# EasyEDA Pro project 电压采样隔离前级.eprj

# Schematic Schematic1
Board Name: Board1; Create Date: 2025-07-23
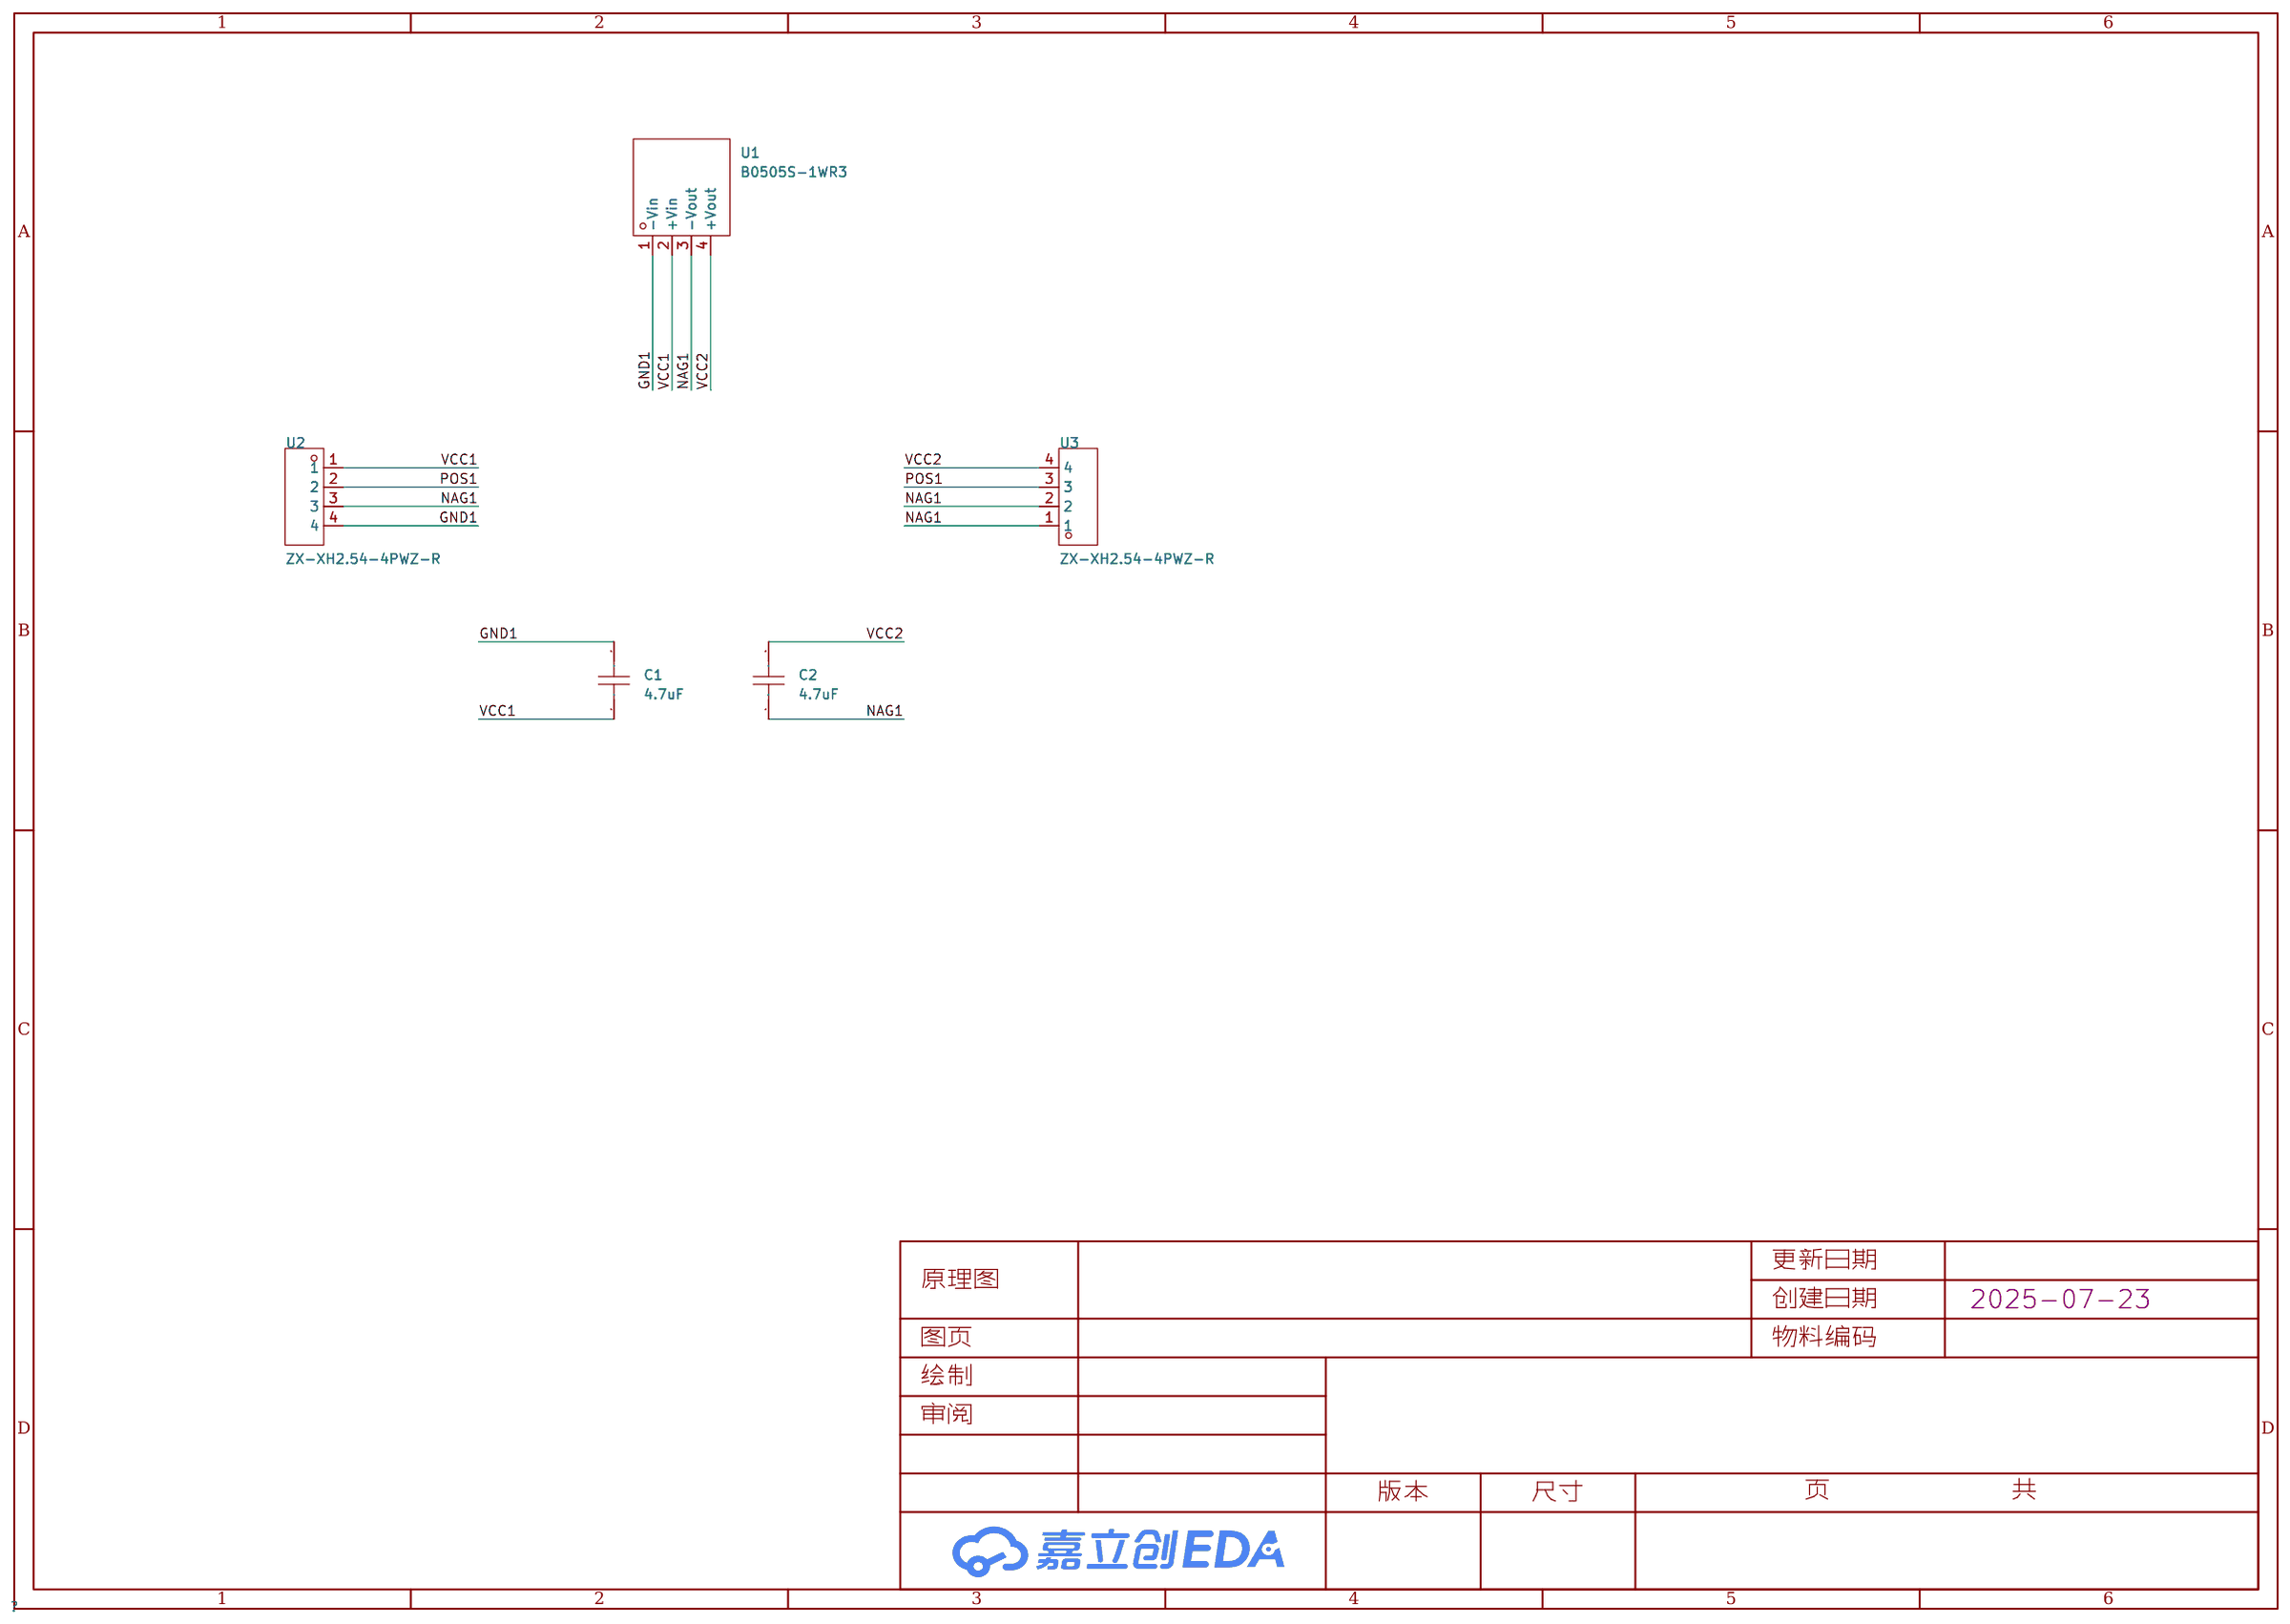
[diagram p0: schematic sheet]

## Parts
C1  4.7uF  [C1206]
C2  4.7uF  [C1206]
U1  B0505S-1WR3  [PWRM-TH_B0505S-1WR3]
U2  ZX-XH2.54-4PWZ-R  [CONN-TH_4P-P2.50_ZX-XH2.54-4PWZ-Y]
U3  ZX-XH2.54-4PWZ-R  [CONN-TH_4P-P2.50_ZX-XH2.54-4PWZ-Y]

## Library data of the parts
C1 C2 = GRM31CC72A475KE11L: LCSC Part Name: 4.7uF ±10% 100V; Supplier Part: C237304; Manufacturer: muRata(村田); Supplier Footprint: 1206; JLCPCB Part Class: 扩展库; Datasheet: https://atta.szlcsc.com/upload/public/pdf/source/20200508/C237304_4DE028CC8A94E401326C46A1633456FC.pdf; Supplier: LCSC; Tolerance: ±10%; Voltage Rated: 100V; Temperature Coefficient: X7S
U1 = B0505S-1WR3_C7465178: LCSC Part Name: DC-DC输入5V输出5V200mA 1W输出短路保护; Supplier Part: C7465178; Manufacturer: EVISUN(易成); Supplier Footprint: SIP-4; JLCPCB Part Class: 扩展库; Datasheet: https://atta.szlcsc.com/upload/public/pdf/source/20230718/BF3EB05DF14EA4A594DA80D4BE82711A.pdf; Supplier: LCSC; Power: 1W; input voltage (Vdc): 4.5V~5.5V; Conversion Efficiency: 86%; Output Voltage: 5V; Output Current (Max): 200mA; Maximum Capacitive Load: 2400uF; Insulated Voltage: 1.5kV; Protective function: 短路保护
U2 U3 = ZX-XH2.54-4PWZ-R: LCSC Part Name: 1x4P 间距:2.5mm 弯插 系列:XH; Supplier Part: C22388621; Manufacturer: Megastar(兆星); Supplier Footprint: 弯插,P=2.5mm; JLCPCB Part Class: 扩展库; Datasheet: https://atta.szlcsc.com/upload/public/pdf/source/20240429/B2359B43FD84E3B0CA319B3026062A11.pdf; Supplier: LCSC; Pins Structure: 1x4P; Pitch: 2.5mm; Mounting Type: 弯插; Reference Series: XH; Number of Pins: 4P; Number of Rows: 1; Number of PINs Per Row: 4; Current Rating: 3A; Contact Material: 铜合金; Contact Plating: 锡; Operating Temperature: -25℃~+85℃; Voltage Rating: 250V; Plastic Material: PA66; Color: 红色; X-Length of Bottom Edge on Board (Spacing Line): 12.5mm

## Nets
GND1: C1.2 U1.1(-Vin) U2.4
VCC1: C1.1 U1.2(+Vin) U2.1
VCC2: C2.2 U1.4(+Vout) U3.4
NAG1: C2.1 U1.3(-Vout) U2.3 U3.1 U3.2
POS1: U2.2 U3.3

# Board PCB1
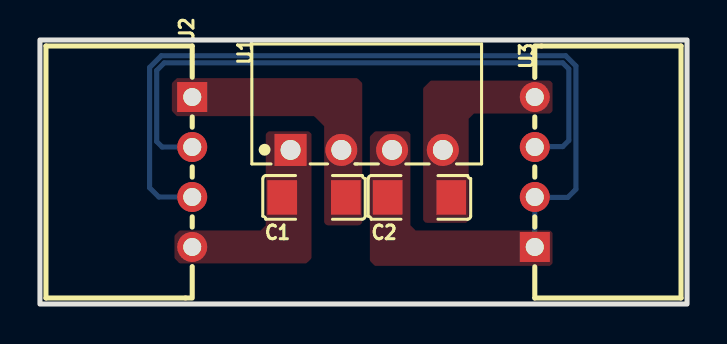
[diagram p1: board, top side]
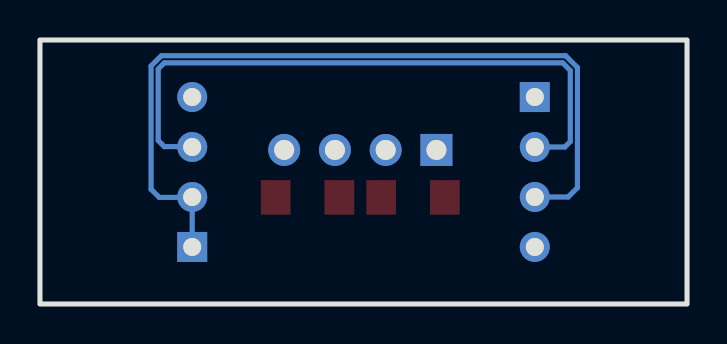
[diagram p2: board, bottom side, seen from below]

Outline 32.38 x 13.21 mm; copper layers: Top Layer, Bottom Layer. Coordinates in mm from the lower left corner of the outline.
Outline path: rectangle 0,13.21 32.38,0
Stack: Top Layer 0.035mm / Dielectric1 1.51mm FR4 er 4.5 / Bottom Layer 0.035mm

## Design rules (mm)
template: 自定义配置
spacing copperThickness1oz (default): track to track 0.102, other pairs 0.152 to 0.3
spacing copperThickness2oz: track to track 0.203, other pairs 0.152 to 0.3
track width copperThickness1oz (default): min 0.127, default 0.254, max 2.54
track width copperThickness2oz: min 0.203, default 0.254, max 2.54
differential pair differentialPair (default): width min 0.127, default 0.254, max 2.54; gap min 0.152, default 0.152
via viaSize (default): diameter min 0.5, default 0.61, max 10; hole min 0.3, default 0.305, max 6.3
net GND1 uses copperRegion1
net VCC1 uses copperRegion1
net VCC2 uses copperRegion1
net NAG1 uses copperRegion1

## Placement (name value [footprint] x y rotation side)
C1  4.7uF  [C1206]  13.72 5.33 180 top
C2  4.7uF  [C1206]  18.99 5.33 0 top
U1  B0505S-1WR3  [PWRM-TH_B0505S-1WR3]  16.35 7.71 0 top
U2  ZX-XH2.54-4PWZ-R  [CONN-TH_4P-P2.50_ZX-XH2.54-4PWZ-Y]  7.62 6.6 270 top
U3  ZX-XH2.54-4PWZ-R  [CONN-TH_4P-P2.50_ZX-XH2.54-4PWZ-Y]  24.76 6.6 90 top

## Footprints (pads in the part's own frame, mm; a bottom-side part is the same pattern mirrored in y, then rotated)
C1206
  rect 1.485x1.728 smd: 1(-1.593,0) 2(1.593,0)
CONN-TH_4P-P2.50_ZX-XH2.54-4PWZ-Y
  rect 1.5x1.5 hole 0.9: 1(-3.75,0)
  round 1.5 hole 0.9: 2(-1.25,0) 3(1.25,0) 4(3.75,0)
PWRM-TH_B0505S-1WR3
  rect 1.6x1.6 hole 1: 1(-3.81,0)
  round 1.6 hole 1: 2(-1.27,0) 3(1.27,0) 4(3.81,0)

## Nets
As in the schematic.

## Routing (per net, layer and track width the routed paths; a pad name or vN(x,y) marks a point on that pad's centre or on a via; arc(x,y) is an arc through that point)
NAG1: length 41
  Bottom Layer w0.254: U3.1 U3.2 24.78,5.33 26.42,5.33 26.82,5.74 26.82,11.91 26.31,12.42 6.08,12.42 5.49,11.83 5.49,5.82 5.95,5.35 U2.3
POS1: length 31.8
  Bottom Layer w0.254: U3.3 24.78,7.87 26.16,7.87 26.47,8.18 26.47,11.76 26.16,12.06 6.22,12.06 5.84,11.68 5.84,8.13 6.12,7.85 U2.2

## Copper pours and planes (outline as drawn; the poured copper is in the pictures)
GND1 on Top Layer: 6.73,3.43 6.98,3.68 11.05,3.68 11.3,3.94 11.3,8.51 11.43,8.64 13.46,8.64 13.59,8.51 13.59,2.29 13.33,2.03 6.98,2.03 6.73,2.29
VCC1 on Top Layer: 6.6,11.05 6.86,11.3 15.88,11.3 16.13,11.05 16.13,4.06 16,3.94 14.35,3.94 14.22,4.06 14.22,8.89 13.72,9.4 6.86,9.4 6.6,9.65
VCC2 on Top Layer: 19.18,10.79 19.56,11.18 25.53,11.18 25.65,11.05 25.65,9.65 25.53,9.52 21.72,9.52 21.46,9.27 21.46,4.19 21.34,4.06 19.3,4.06 19.18,4.19
NAG1 on Top Layer: 16.51,8.38 16.76,8.64 18.41,8.64 18.54,8.51 18.54,3.94 18.8,3.68 25.53,3.68 25.65,3.56 25.65,2.03 25.53,1.9 16.76,1.9 16.51,2.16
